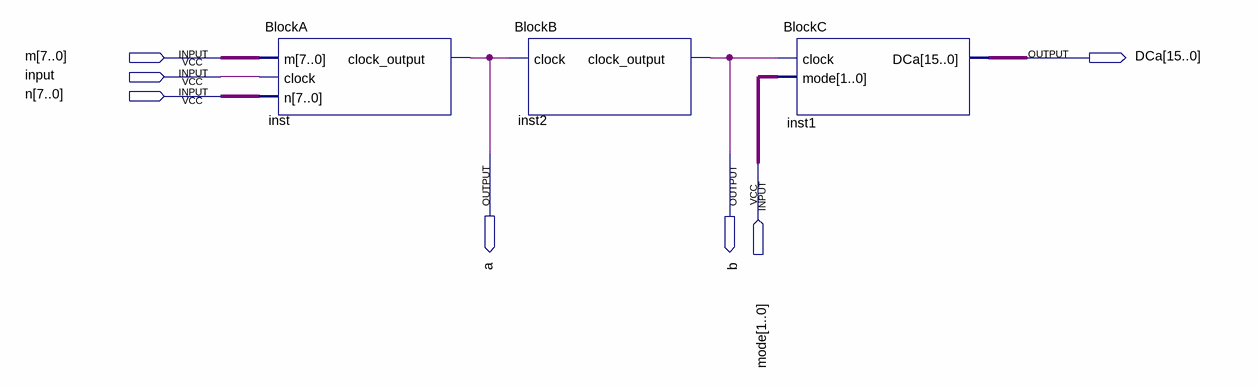
[diagram p0: schematic sheet]
// Quartus schematic Main.bdf as structural Verilog: 3 symbols, 7 pins
module Main (
  input  [7:0] m,
  input  \input ,
  input  [7:0] n,
  input  [1:0] mode,
  output [15:0] DCa,
  output a,
  output b
);

  BlockA inst (.m(m), .clock(\input ), .n(n), .clock_output(a));
  BlockB inst2 (.clock(a), .clock_output(b));
  BlockC inst1 (.clock(b), .mode(mode), .DCa(DCa));
endmodule
